# EAGLE design R2-mechanisms (EAGLE 9.6.2)
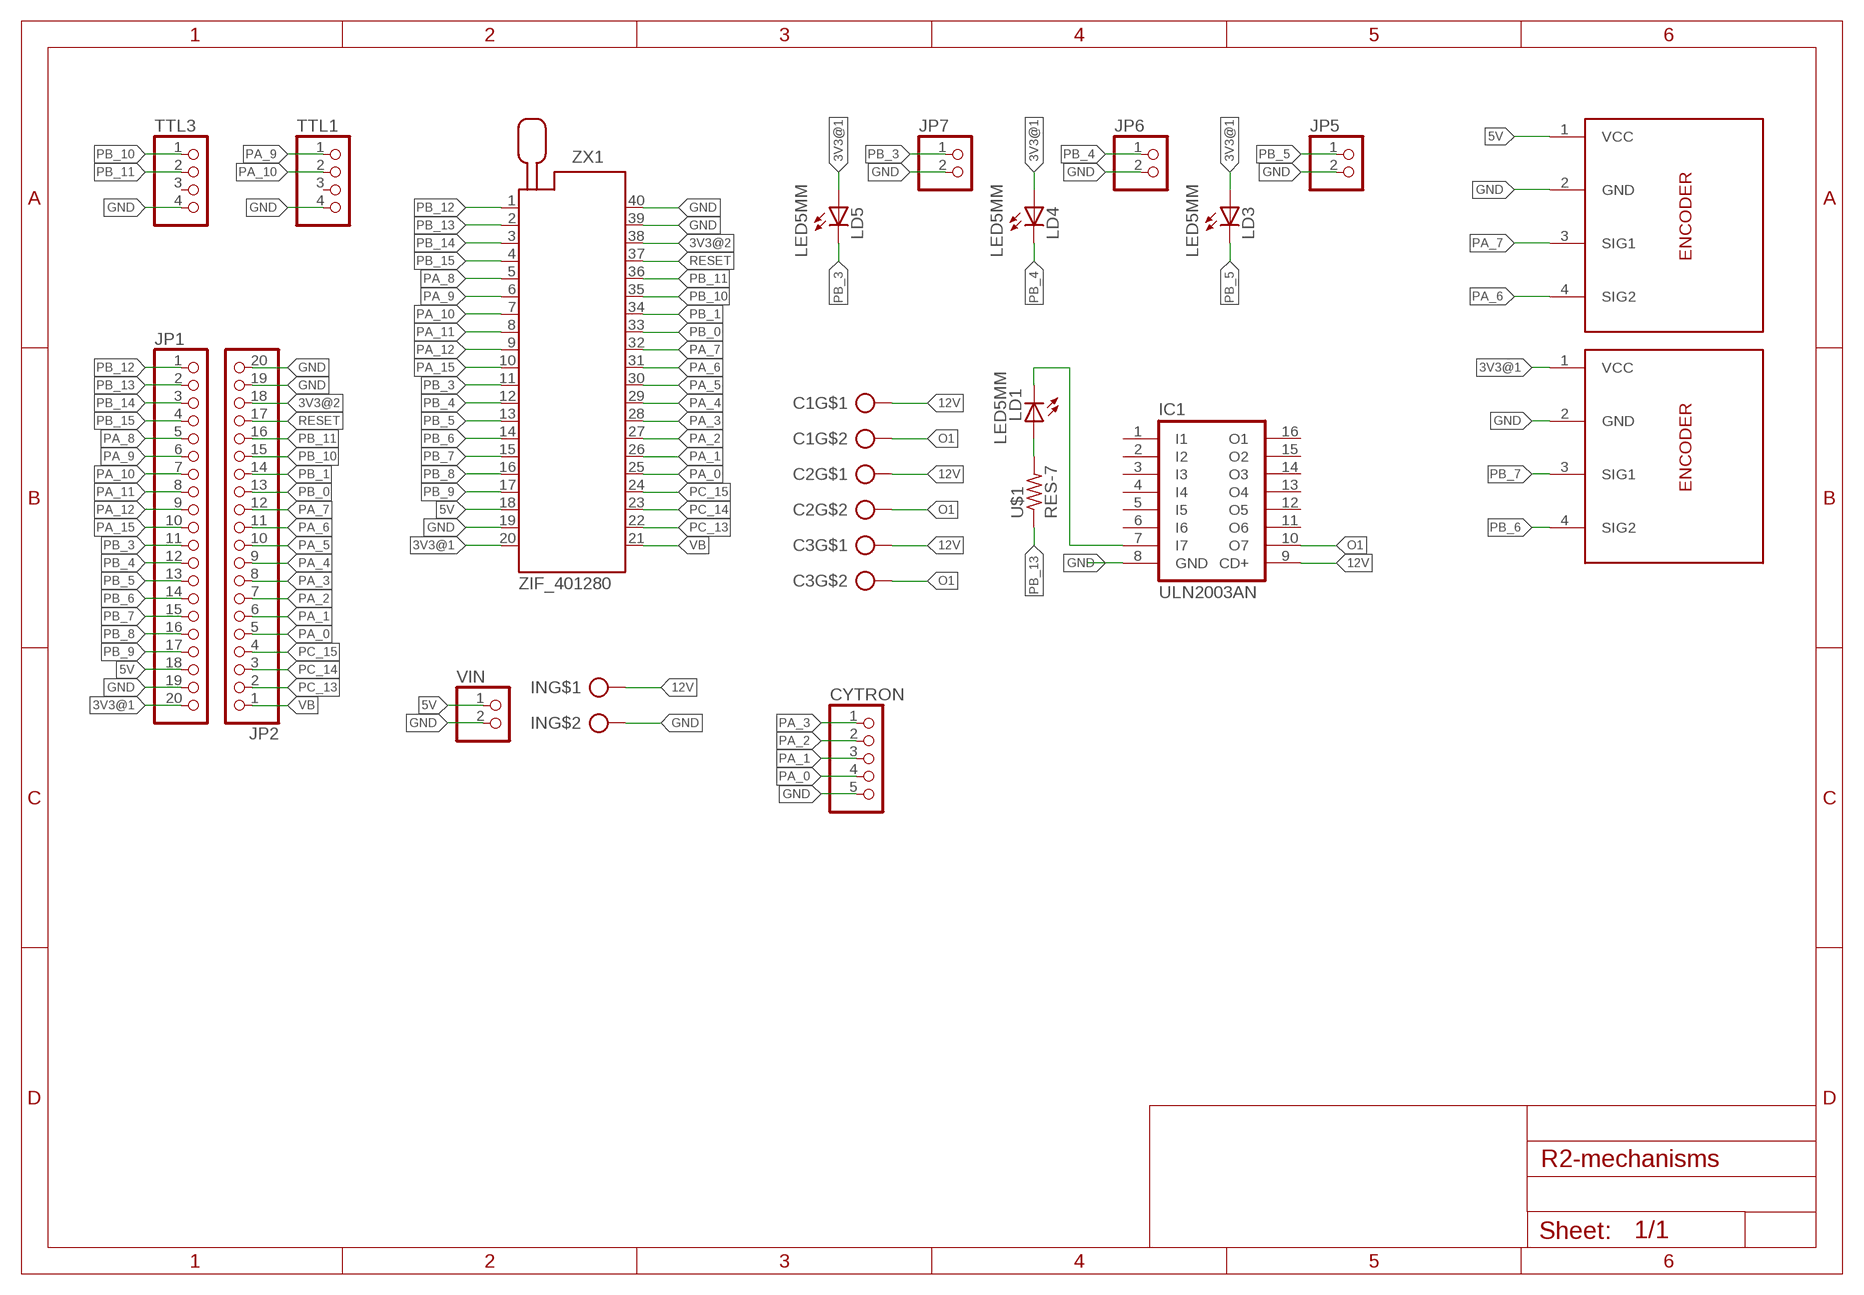
[diagram p0: schematic, sheet 1]

## Parts
C1  CON_PTR_2  [AK300/2]
C2  CON_PTR_2  [AK300/2]
C3  CON_PTR_2  [AK300/2]
CYTRON  PINHD-5_DATA  [1X05_DATA]
ENC  ENCODER  [1X04_DATA]
ENC1  ENCODER  [1X04_DATA]
IC1  ULN2003AN  [DIL16]
IN  CON_PTR_2  [AK300/2]
JP1  PINHD-1X20  [1X20]
JP2  PINHD-1X20  [1X20]
JP5  PINHD-2_DATA  [1X02_DATA]
JP6  PINHD-2_DATA  [1X02_DATA]
JP7  PINHD-2_DATA  [1X02_DATA]
LD1  LED5MM  [LED5MM]
LD3  LED5MM  [LED5MM]
LD4  LED5MM  [LED5MM]
LD5  LED5MM  [LED5MM]
TTL1  PINHD-4_DATA  [1X04_DATA]
TTL3  PINHD-4_DATA  [1X04_DATA]
U$1  RES-7  [0204/7]
VIN  PINHD-2_DATA  [1X02_DATA]
ZX1  ZIF_401280  [240-1280-00-0602J]

## Nets
3V3@1: ENC1.1(VCC) JP1.20 LD3.A LD4.A LD5.A ZX1.20
3V3@2: JP2.18 ZX1.38
5V: ENC.1(VCC) JP1.18 VIN.1 ZX1.18
12V: C1.1 C2.1 C3.1 IC1.9(CD+) IN.1
GND: CYTRON.5 ENC1.2(GND) ENC.2(GND) IC1.8(GND) IN.2 JP1.19 JP2.19 JP2.20 JP5.2 JP6.2 JP7.2 TTL1.4 TTL3.4 VIN.2 ZX1.19 ZX1.39 ZX1.40
N$1: IC1.7(I7) LD1.K(C)
N$8: LD1.A U$1.2
O1: C1.2 C2.2 C3.2 IC1.10(O7)
PA_0: CYTRON.4 JP2.5 ZX1.25
PA_1: CYTRON.3 JP2.6 ZX1.26
PA_2: CYTRON.2 JP2.7 ZX1.27
PA_3: CYTRON.1 JP2.8 ZX1.28
PA_4: JP2.9 ZX1.29
PA_5: JP2.10 ZX1.30
PA_6: ENC.4(SIG2) JP2.11 ZX1.31
PA_7: ENC.3(SIG1) JP2.12 ZX1.32
PA_8: JP1.5 ZX1.5
PA_9: JP1.6 TTL1.1 ZX1.6
PA_10: JP1.7 TTL1.2 ZX1.7
PA_11: JP1.8 ZX1.8
PA_12: JP1.9 ZX1.9
PA_15: JP1.10 ZX1.10
PB_0: JP2.13 ZX1.33
PB_1: JP2.14 ZX1.34
PB_3: JP1.11 JP7.1 LD5.K(C) ZX1.11
PB_4: JP1.12 JP6.1 LD4.K(C) ZX1.12
PB_5: JP1.13 JP5.1 LD3.K(C) ZX1.13
PB_6: ENC1.4(SIG2) JP1.14 ZX1.14
PB_7: ENC1.3(SIG1) JP1.15 ZX1.15
PB_8: JP1.16 ZX1.16
PB_9: JP1.17 ZX1.17
PB_10: JP2.15 TTL3.1 ZX1.35
PB_11: JP2.16 TTL3.2 ZX1.36
PB_12: JP1.1 ZX1.1
PB_13: JP1.2 U$1.1 ZX1.2
PB_14: JP1.3 ZX1.3
PB_15: JP1.4 ZX1.4
PC_13: JP2.2 ZX1.22
PC_14: JP2.3 ZX1.23
PC_15: JP2.4 ZX1.24
RESET: JP2.17 ZX1.37
VB: JP2.1 ZX1.21
Unconnected: IC1.1(I1) IC1.2(I2) IC1.3(I3) IC1.4(I4) IC1.5(I5) IC1.6(I6) IC1.11(O6) IC1.12(O5) IC1.13(O4) IC1.14(O3) IC1.15(O2) IC1.16(O1) TTL1.3 TTL3.3

## Library data of the parts
C1-C3 IN = MIA_LIBRARY-2-2-2:CON_PTR_2
CYTRON = MIA_LIBRARY-2-2-2:PINHD-5_DATA: PIN HEADER
ENC ENC1 = MIA_LIBRARY-2-2-2:ENCODER
IC1 = uln-udn:ULN2003A: DRIVER ARRAY
JP1 JP2 = MIA_LIBRARY-2-2-2:PINHD-1X20: PIN HEADER
JP5-JP7 VIN = MIA_LIBRARY-2-2-2:PINHD-2_DATA: PIN HEADER
LD1 LD3-LD5 = MIA_LIBRARY-2-2-2:LED5MM
TTL1 TTL3 = MIA_LIBRARY-2-2-2:PINHD-4_DATA: PIN HEADER
U$1 = MIA_LIBRARY-2-2-2:RES-7
ZX1 = MIA_LIBRARY-2-2-2:ZIF_40: Zero Insertion Force Socked Source: http://www.3M.com/ehpd

## Board
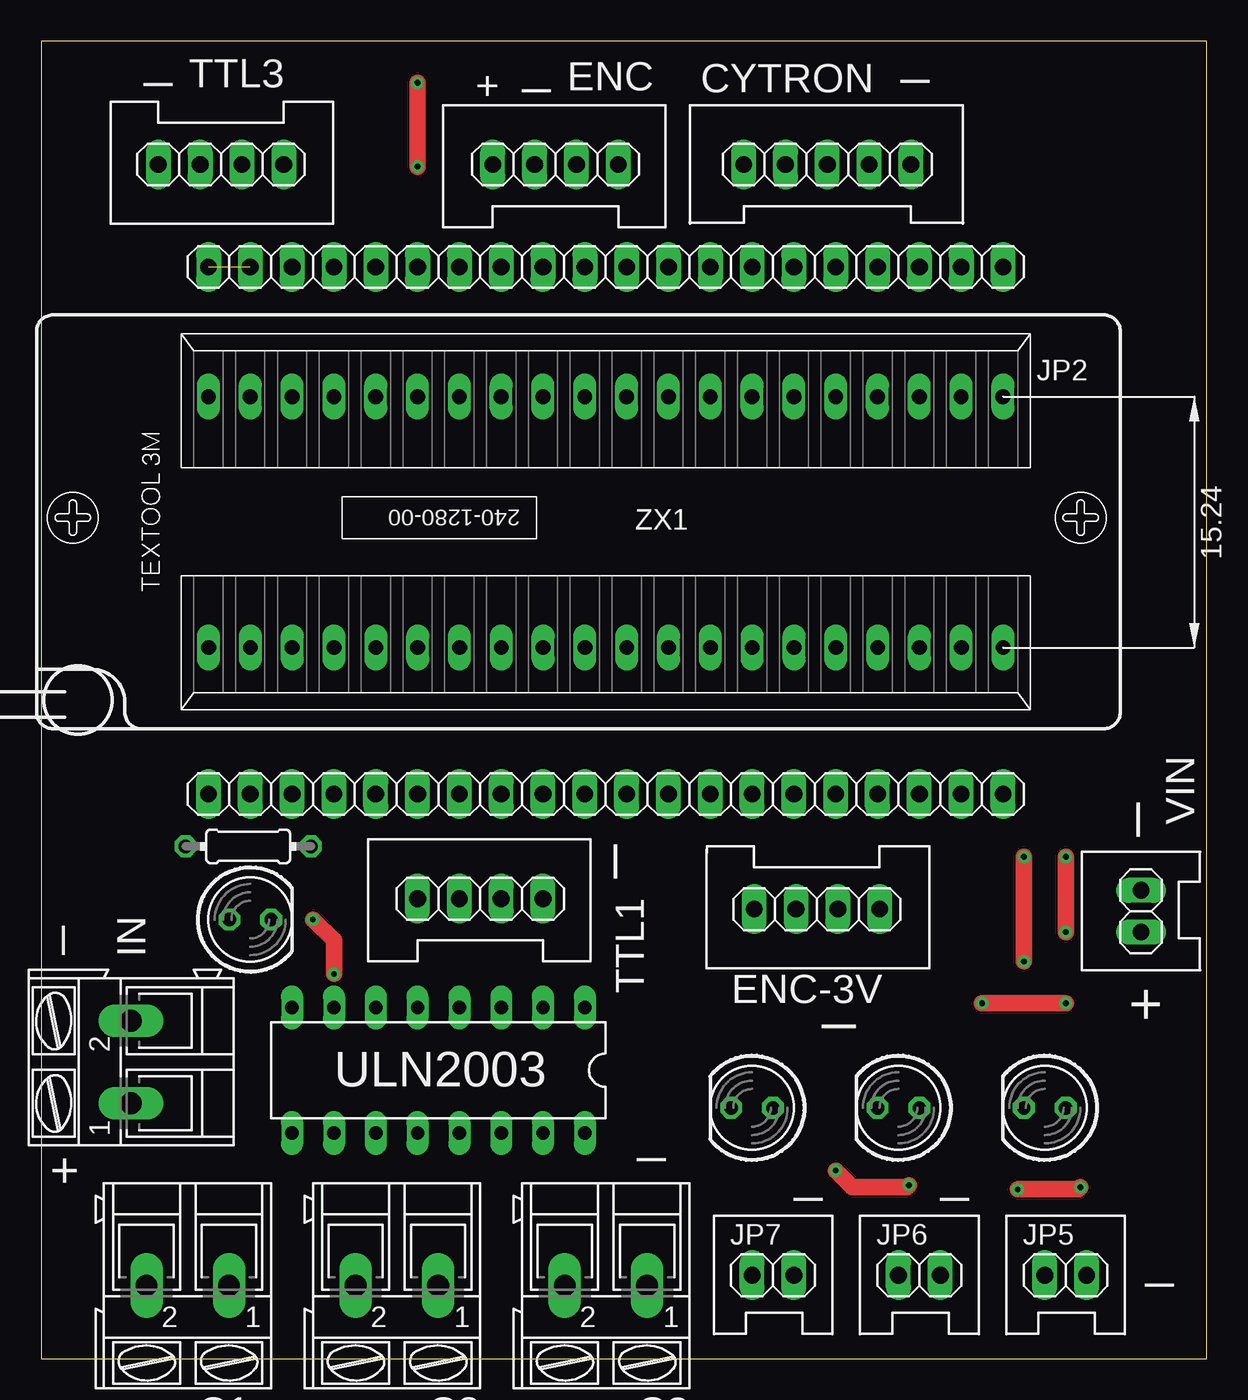
[diagram p1: board, top side]
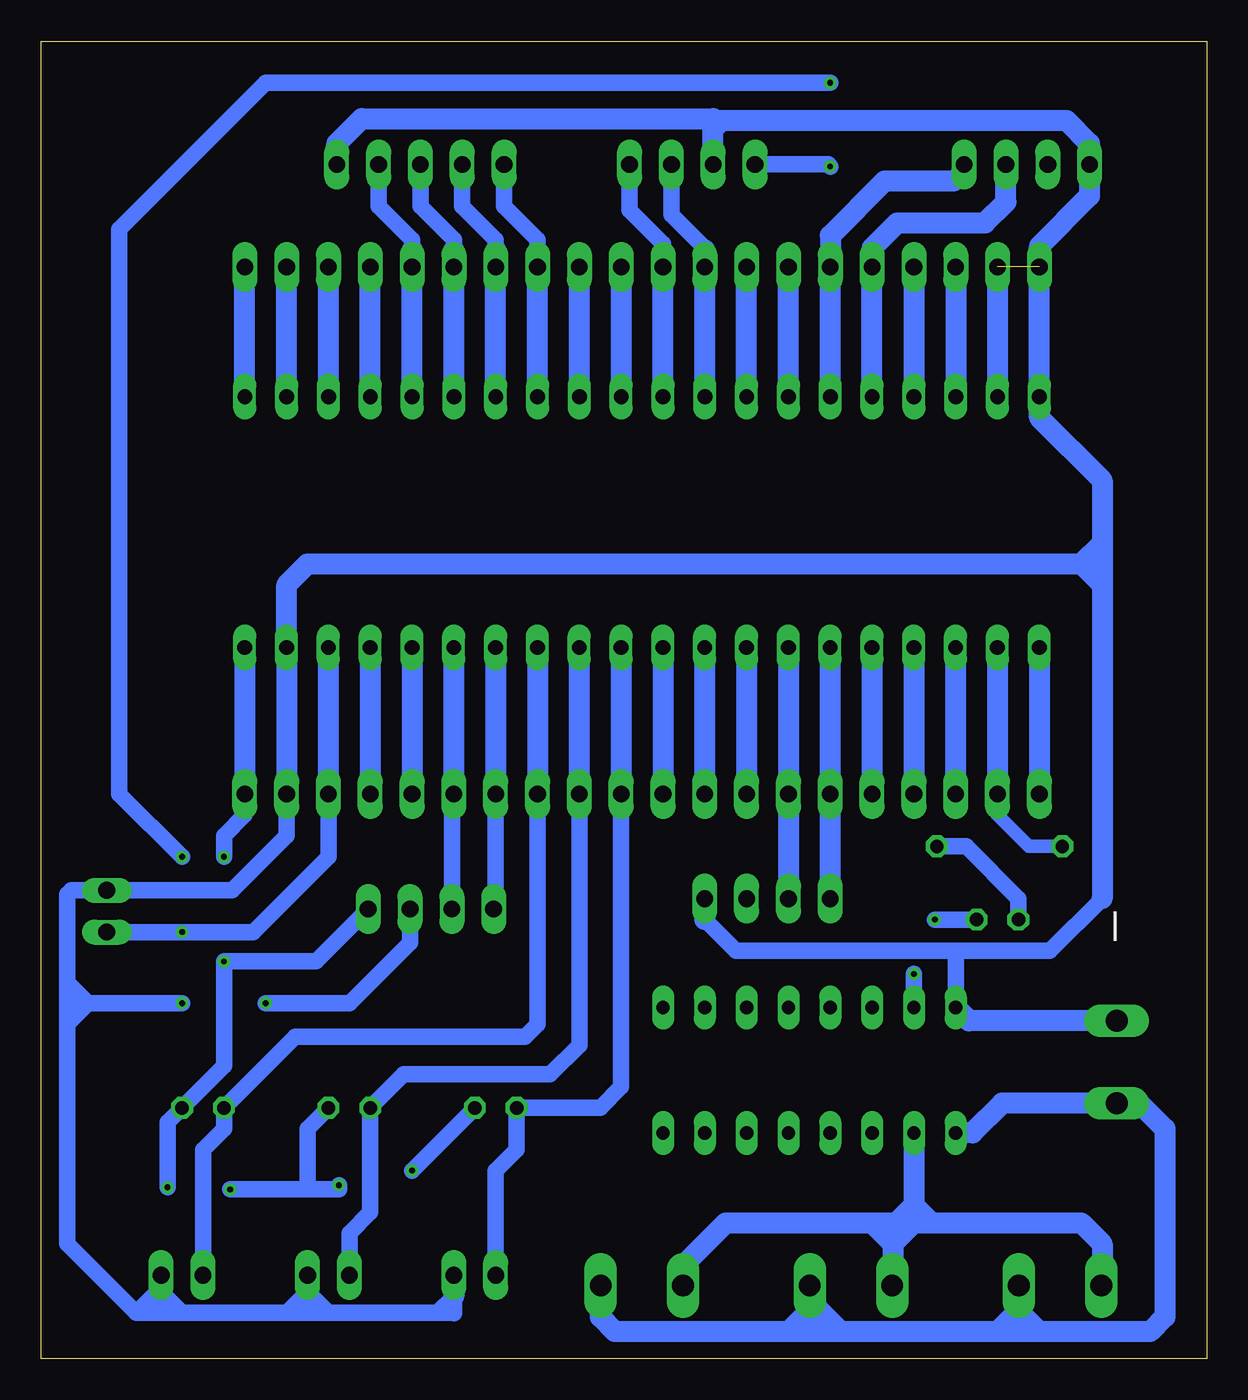
[diagram p2: board, bottom side, seen from below]

Size 70.79 x 80 mm. Coordinates in mm from the lower left corner, seen from the top.
Outline: 0,0 70.79,0 70.79,80 0,80 0,0
Copper layers (1*16): Top 0.035mm / dielectric 1.5mm / Bottom 0.035mm
Design rules "default": minimum track width 6mil, minimum drill 0.35mm, track to track 6mil, track to pad 6mil, pad to pad 6mil, via to via 6mil, smd to smd 6mil, copper to edge 40mil, drill to drill 6mil, minimum pad ring 10mil, minimum via ring 8mil, stop-mask expansion 4mil, vias tented up to drill 0mil, thermal gap 10mil

### Footprints (pad centres in the part's own frame; a part is rotated, then mirrored left to right if it is on the bottom)
AK300/2 = drill 1.321 long: 1 -2.515,0; 2 2.489,0
1X05_DATA = drill 1.016 long: 1 -5.08,0; 2 -2.54,0; 3 0,0; 4 2.54,0; 5 5.08,0
1X04_DATA = drill 1.016 long: 1 -3.81,0; 2 -1.27,0; 3 1.27,0; 4 3.81,0
DIL16 = drill 0.813 long: 1 -8.89,-3.81; 2 -6.35,-3.81; 3 -3.81,-3.81; 4 -1.27,-3.81; 5 1.27,-3.81; 6 3.81,-3.81; 7 6.35,-3.81; 8 8.89,-3.81; 9 8.89,3.81; 10 6.35,3.81; 11 3.81,3.81; 12 1.27,3.81; 13 -1.27,3.81; 14 -3.81,3.81; 15 -6.35,3.81; 16 -8.89,3.81
1X20 = drill 1.016 long: 1 -24.13,0; 2 -21.59,0; 3 -19.05,0; 4 -16.51,0; 5 -13.97,0; 6 -11.43,0; 7 -8.89,0; 8 -6.35,0; 9 -3.81,0; 10 -1.27,0; 11 1.27,0; 12 3.81,0; 13 6.35,0; 14 8.89,0; 15 11.43,0; 16 13.97,0; 17 16.51,0; 18 19.05,0; 19 21.59,0; 20 24.13,0
1X02_DATA = drill 1.016 long: 1 -1.27,0; 2 1.27,0
LED5MM = drill 0.813 octagon: A -1.27,0; K 1.27,0
0204/7 = drill 0.813 octagon: 1 -3.81,0; 2 3.81,0
240-1280-00-0602J = drill 0.9 long: 1 -24.12,-8.88; 2 -21.58,-8.88; 3 -19.04,-8.88; 4 -16.5,-8.88; 5 -13.96,-8.88; 6 -11.42,-8.88; 7 -8.88,-8.88; 8 -6.34,-8.88; 9 -3.8,-8.88; 10 -1.26,-8.88; 11 1.28,-8.88; 12 3.82,-8.88; 13 6.36,-8.88; 14 8.9,-8.88; 15 11.44,-8.88; 16 13.98,-8.88; 17 16.52,-8.88; 18 19.06,-8.88; 19 21.6,-8.88; 20 24.14,-8.88; 21 24.13,6.35; 22 21.59,6.35; 23 19.05,6.35; 24 16.51,6.35; 25 13.97,6.35; 26 11.43,6.35; 27 8.89,6.35; 28 6.35,6.35; 29 3.81,6.35; 30 1.27,6.35; 31 -1.27,6.35; 32 -3.81,6.35; 33 -6.35,6.35; 34 -8.89,6.35; 35 -11.43,6.35; 36 -13.97,6.35; 37 -16.51,6.35; 38 -19.05,6.35; 39 -21.59,6.35; 40 -24.13,6.35

### Placement (x,y rotation side)
C1  8.89,4.45 180 top
C2  21.59,4.45 180 top
C3  34.29,4.45 180 top
CYTRON  47.75,72.52 0 top
ENC  31.24,72.52 0 top
ENC1  47.12,27.3 180 top
IC1  24.13,17.53 180 top
IN  5.46,18.03 90 top
JP1  34.29,34.29 0 top
JP2  34.29,66.29 180 top
JP5  62.23,5.08 0 top
JP6  53.34,5.08 0 top
JP7  44.45,5.08 0 top
LD1  12.7,26.67 0 top
LD3  60.96,15.24 180 top
LD4  52.07,15.24 180 top
LD5  43.18,15.24 180 top
TTL1  26.67,27.94 0 top
TTL3  10.92,72.52 180 top
U$1  12.57,31.11 0 top
VIN  66.8,27.18 90 top
ZX1  34.29,52.07 0 top

### Tracks (layer width: path | path; a pad name or v marks a point on that pad's centre or on a via)
3V3@1  (via drill 0.35)
  Top 1.016: v48.26,11.43 49.28,10.41 52.58,10.41 v52.7,10.54 | v59.31,10.29 62.99,10.29 v63.12,10.41 | v59.69,24.13 v59.69,30.48
  Bottom 1.016: LD5.A v48.26,11.43 | v52.7,10.54 52.7,10.29 54.61,10.29 | 54.61,10.29 v59.31,10.29 | v63.12,10.41 63.12,14.35 LD3.A 59.69,17.78 v59.69,24.13 54.1,24.13 ENC1.1 | 54.61,10.29 54.61,13.97 LD4.A | v59.69,30.48 59.69,31.75 58.42,33.02 JP1.20
  Bottom 1.27: ZX1.20 JP1.20
3V3@2
  Bottom 1.27: JP2.18 ZX1.38
5V  (via drill 0.35)
  Top 1.016: v22.86,72.39 v22.86,77.47 | v62.23,25.91 v62.23,30.48
  Bottom 1.016: JP1.18 53.34,30.48 57.91,25.91 v62.23,25.91 VIN.1 | ENC.1 22.99,72.52 v22.86,72.39 | v22.86,77.47 57.15,77.47 66.04,68.58 66.04,34.29 v62.23,30.48
  Bottom 1.27: ZX1.18 53.35,35.56 | 53.35,35.56 JP1.18 | 53.35,35.56 53.34,35.55
12V
  Bottom 1.016: C3.1 36.8,5.05 36.83,5.08
  Bottom 1.27: IC1.9 14.22,13.72 12.42,15.52 IN.1 4.09,15.52 2.54,13.97 2.54,2.54 3.43,1.65 10.16,1.65 | 11.43,5.71 11.43,4.47 | 11.43,4.47 C1.1 11.43,4.42 | C2.1 24.11,3.53 22.23,1.65 | 36.83,4.45 C3.1 | 10.16,1.65 11.43,2.92 | 11.43,4.42 11.43,4.47 | 10.16,1.65 11.43,1.65 | 11.43,1.65 12.7,1.65 | 12.7,1.65 22.23,1.65 | 22.23,1.65 24.13,1.65 | 24.13,1.65 25.4,1.65 | 25.4,1.65 35.94,1.65 36.83,2.54 36.83,5.03 36.8,5.05 | 11.43,4.42 11.43,2.92 | 11.43,2.92 11.43,1.65 | C2.1 24.11,1.68 24.13,1.65 | C2.1 24.11,2.95 25.4,1.65 | 12.7,1.65 11.43,2.92
GND  (via drill 0.35)  (1 unrouted)
  Top 1.016: v57.15,21.59 v62.23,21.59
  Bottom 1.016: 30.48,26.67 28.57,24.77 15.24,24.77 | 6.35,27.94 9.53,24.77 15.24,24.77 | IC1.8 15.24,24.77 | 46.74,2.79 45.72,3.81 45.72,3.31 | 53.34,2.79 46.74,2.79 | 53.34,2.79 54.61,4.06 | 53.34,2.79 55.88,2.79 | 55.88,2.79 62.23,2.79 | 63.5,4.06 62.23,2.79 | 45.72,2.81 46.74,2.79 | 45.72,2.81 45.72,3.31 | 45.72,2.78 45.72,3.31 | JP1.19 55.88,31.75 59.18,28.45 VIN.2 68.96,28.45 69.22,28.19 69.22,22.86 | 69.22,22.86 69.22,21.59 | 69.22,21.59 69.22,20.32 | 69.22,20.32 69.22,6.99 65.02,2.79 | 65.02,2.79 63.5,2.79 | 63.5,2.79 62.23,2.79 | 63.5,2.79 JP5.2 63.5,4.32 65.02,2.79 | JP6.2 54.61,4.06 | 54.61,4.06 55.88,2.79 | ENC1.2 48.39,25.27 52.07,21.59 v57.15,21.59 | v62.23,21.59 67.94,21.59 | 67.94,21.59 69.22,21.59 | 67.94,21.59 69.22,20.32 | 67.94,21.59 69.22,22.86 | 45.72,2.81
  Bottom 1.27: JP1.19 ZX1.19 55.88,46.99 54.61,48.26 7.62,48.26 | JP2.19 ZX1.39 | 30.48,26.67 TTL1.4 | 6.35,49.53 6.35,53.34 10.16,57.15 ZX1.40 JP2.20 10.16,67.56 7.11,70.61 TTL3.4 7.11,73.79 8.5,75.17 29.46,75.17 | 6.35,49.53 6.35,48.26 | 6.35,48.26 6.35,46.99 | 6.35,46.99 6.35,27.94 | IC1.8 14.43,20.52 IN.2 4.7,20.52 | 29.46,75.17 29.97,74.67 | ENC.2 29.97,74.67 | CYTRON.5 52.83,73.79 51.32,75.3 29.97,75.3 29.97,75.17 | 29.97,75.17 29.46,75.17 | 29.97,74.67 29.97,75.17 | JP7.2 45.72,3.81 | 7.62,48.26 6.35,48.26 | 7.62,48.26 6.35,49.53 | 7.62,48.26 6.35,46.99 | 54.61,2.92 JP6.2 | JP5.2 63.5,4.06
N$1  (via drill 0.35)
  Top 1.016: v16.51,26.67 17.78,25.4 v17.78,23.37
  Bottom 1.016: LD1.K v16.51,26.67 | v17.78,23.37 IC1.7
N$8
  Bottom 1.016: U$1.2 14.61,31.11 11.43,27.94 LD1.A
O1
  Bottom 1.016: 19.05,8.26 17.78,9.53 16.51,8.26 | C1.2 6.4,3.86 6.35,3.81
  Bottom 1.27: IC1.10 17.78,9.53 17.78,8.26 | 19.05,8.26 19.05,6.99 | 19.05,6.99 19.05,3.81 | 19.05,3.81 19.05,3.17 | C3.2 31.75,4.5 31.75,5.71 29.21,8.26 20.32,8.26 | 20.32,8.26 19.05,8.26 | 19.05,8.26 17.78,8.26 | 17.78,8.26 16.51,8.26 7.62,8.26 6.35,6.99 6.35,4.5 C1.2 | 20.32,8.26 19.05,6.99 | 19.05,6.99 17.78,8.26 | C2.2 19.1,3.86 19.05,3.81
PA_0
  Bottom 1.016: CYTRON.4 50.29,69.98 48.26,67.94 48.26,67.31
  Bottom 1.27: ZX1.25 JP2.5 48.26,67.31
PA_1
  Bottom 1.016: CYTRON.3 47.75,69.98 45.72,67.94 45.72,67.31
  Bottom 1.27: ZX1.26 JP2.6 45.72,67.31
PA_2
  Bottom 1.016: CYTRON.2 45.21,69.98 43.18,67.94 43.18,67.31
  Bottom 1.27: ZX1.27 JP2.7 43.18,67.31
PA_3
  Bottom 1.016: JP2.8 40.64,67.94 42.67,69.98 CYTRON.1
  Bottom 1.27: ZX1.28 JP2.8
PA_4
  Bottom 1.27: ZX1.29 JP2.9
PA_5
  Bottom 1.27: JP2.10 ZX1.30
PA_6
  Bottom 1.016: JP2.11 33.02,67.69 35.05,69.72 ENC.4
  Bottom 1.27: ZX1.31 JP2.11
PA_7
  Bottom 1.016: ENC.3 32.51,69.47 30.48,67.44 30.48,67.31
  Bottom 1.27: ZX1.32 JP2.12 30.48,67.31
PA_8
  Bottom 1.27: ZX1.5 JP1.5
PA_9
  Bottom 1.27: ZX1.6 JP1.6 TTL1.1
PA_10
  Bottom 1.27: ZX1.7 JP1.7 TTL1.2
PA_11
  Bottom 1.27: ZX1.8 JP1.8
PA_12
  Bottom 1.27: ZX1.9 JP1.9
PA_15
  Bottom 1.27: ZX1.10 JP1.10
PB_0
  Bottom 1.27: ZX1.33 JP2.13
PB_1
  Bottom 1.27: ZX1.34 JP2.14 25.27,66.42
PB_3
  Bottom 1.016: JP1.11 35.56,16.51 36.83,15.24 LD5.K 41.91,12.7 43.18,11.43 JP7.1
  Bottom 1.27: ZX1.11 JP1.11
PB_4
  Bottom 1.016: JP1.12 38.1,19.05 39.88,17.27 48.77,17.27 LD4.K 50.8,8.89 52.07,7.62 JP6.1
  Bottom 1.27: ZX1.12 JP1.12
PB_5
  Bottom 1.016: JP1.13 40.64,20.32 41.4,19.56 55.37,19.56 LD3.K 59.69,13.97 60.96,12.7 JP5.1
  Bottom 1.27: ZX1.13 JP1.13
PB_6
  Bottom 1.016: ENC1.4 43.19,27.42 JP1.14
  Bottom 1.27: ZX1.14 JP1.14
PB_7
  Bottom 1.016: ENC1.3 45.85,31.75 45.85,34.16 | 45.85,34.16 45.85,34.18 JP1.15 | JP1.15 45.85,34.16
  Bottom 1.27: ZX1.15 JP1.15
PB_8
  Bottom 1.27: ZX1.16 JP1.16
PB_9
  Bottom 1.27: ZX1.17 JP1.17
PB_10
  Bottom 1.27: ZX1.35 JP2.15 22.86,68.2 19.56,71.5 15.37,71.5 14.73,72.14 TTL3.1
PB_11
  Bottom 1.27: ZX1.36 JP2.16 20.32,67.44 18.8,68.96 13.46,68.96 12.19,70.23 TTL3.2
PB_12
  Bottom 1.27: ZX1.1 JP1.1
PB_13
  Bottom 0.813: U$1.1 10.79,31.11 12.7,33.02 JP1.2
  Bottom 1.27: ZX1.2 JP1.2
PB_14
  Bottom 1.27: ZX1.3 JP1.3
PB_15
  Bottom 1.27: ZX1.4 JP1.4
PC_13
  Bottom 1.27: ZX1.22 JP2.2
PC_14
  Bottom 1.27: ZX1.23 JP2.3
PC_15
  Bottom 1.27: ZX1.24 JP2.4
RESET
  Bottom 1.27: JP2.17 ZX1.37
VB
  Bottom 1.27: ZX1.21 JP2.1

### Text on the board
tPlace: _ | _ | _ | + | + | ULN2003
tNames: _ | _ | _ | ENC-3V | _ | _ | + | _ | _ | _
bNames: _